# EAGLE design MMMM Top (EAGLE 9.1.1)
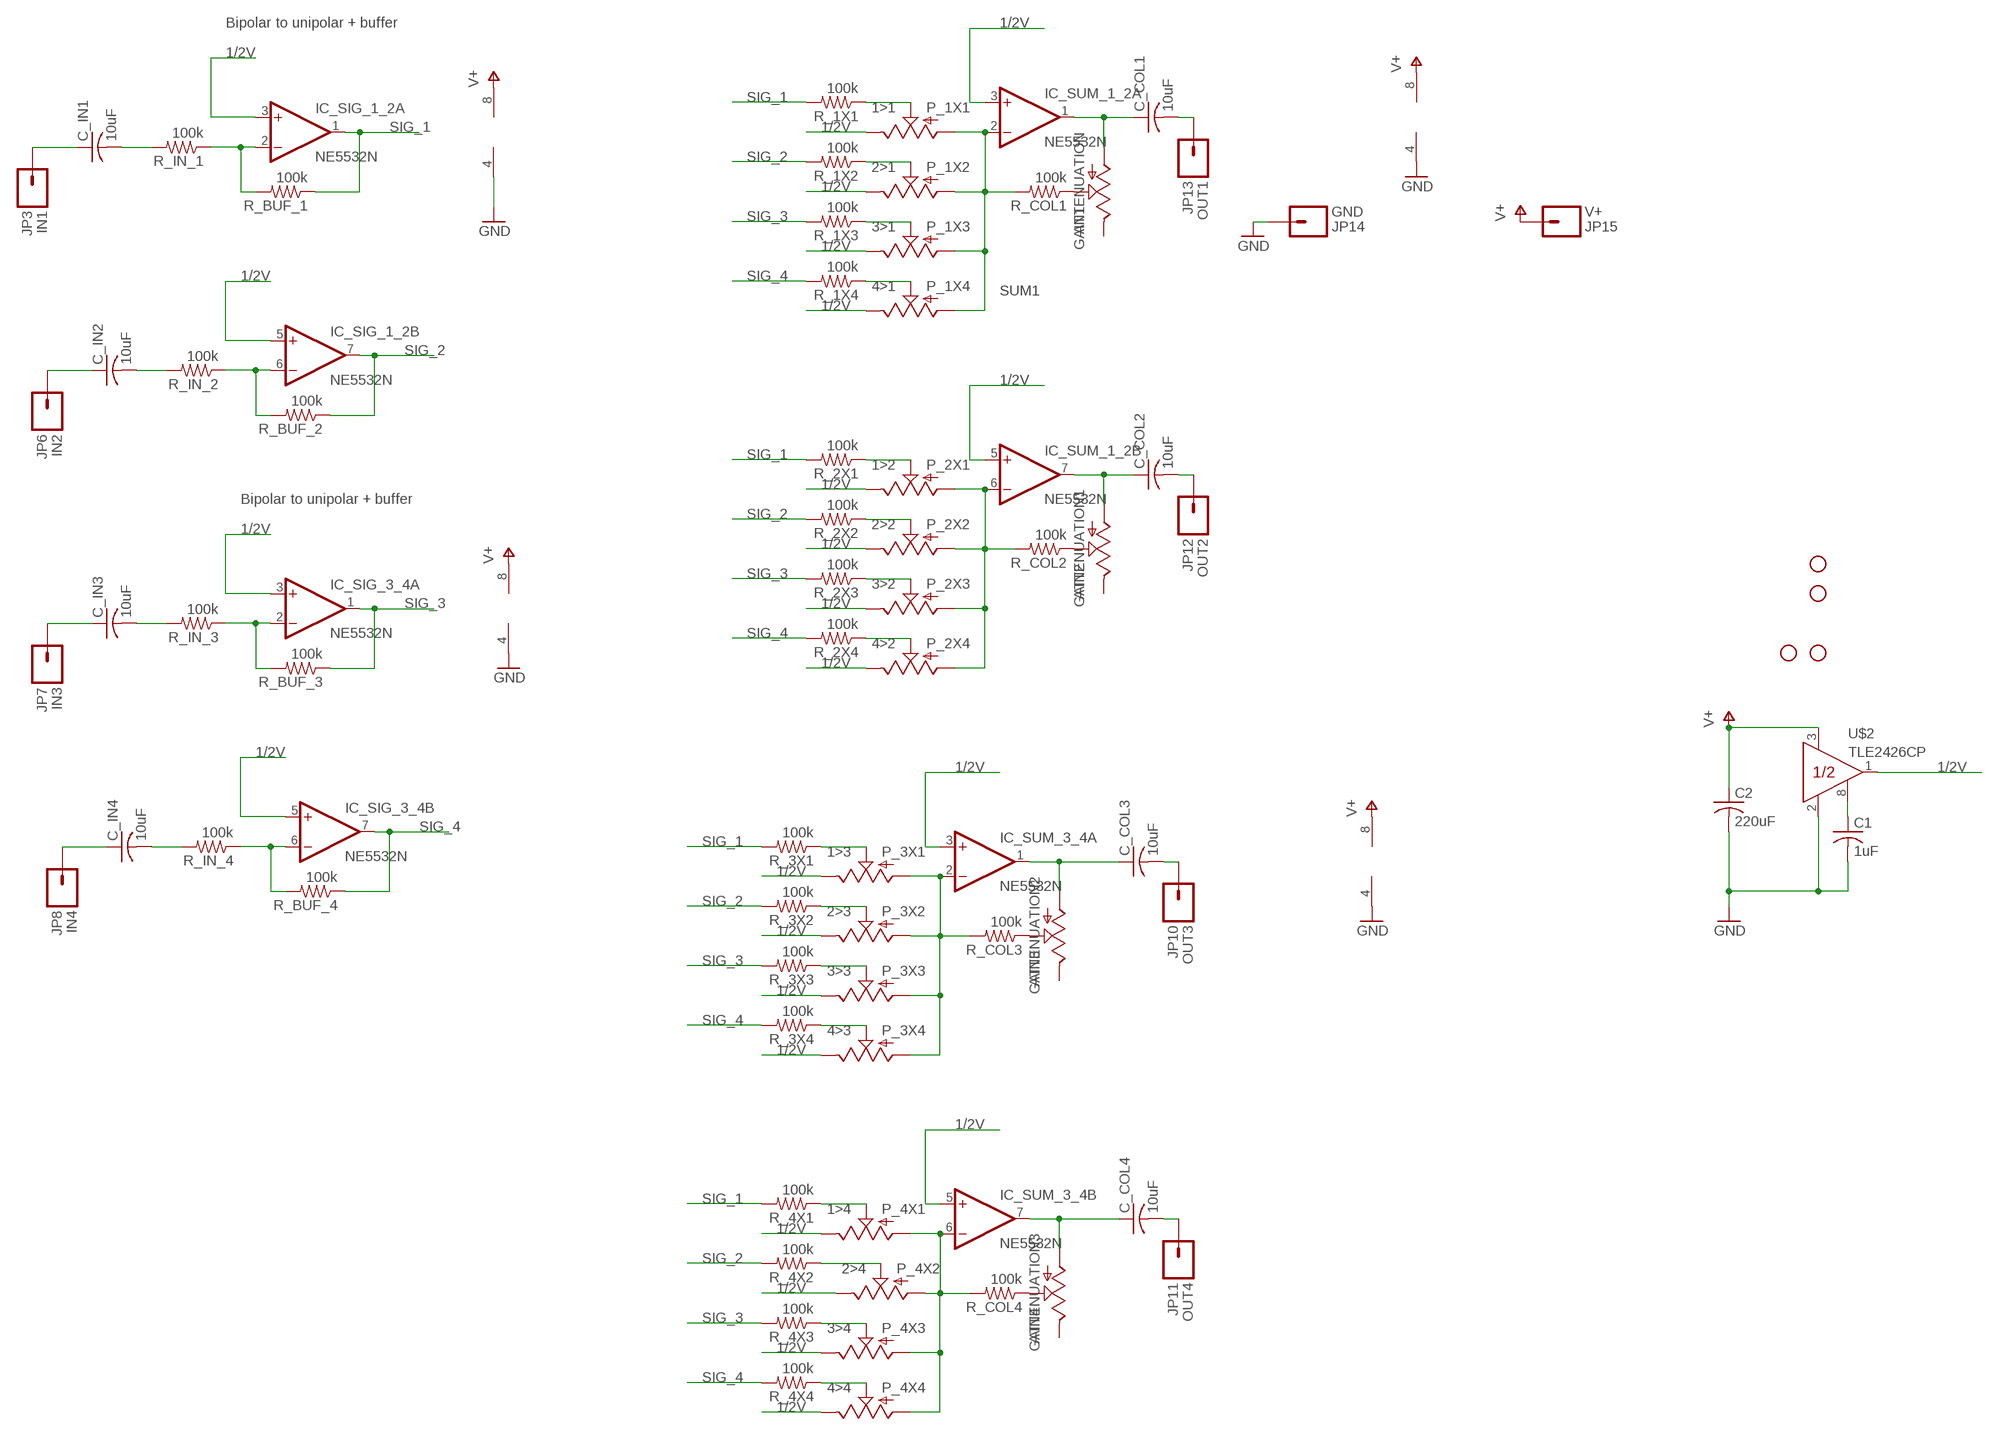
[diagram p0: schematic, sheet 1]

## Parts
ATTENUATION  GAIN1  POTTRIM  [TRIM_POT]
ATTENUATION1  GAIN2  POTTRIM  [TRIM_POT]
ATTENUATION2  GAIN3  POTTRIM  [TRIM_POT]
ATTENUATION3  GAIN4  POTTRIM  [TRIM_POT]
C1  1uF  C-US025-030X050  [C025-030X050]
C2  220uF  C-US050-075X075  [C050-075X075]
C_COL1  10uF  C-US025-025X050  [C025-025X050]
C_COL2  10uF  C-US025-025X050  [C025-025X050]
C_COL3  10uF  C-US025-025X050  [C025-025X050]
C_COL4  10uF  C-US025-025X050  [C025-025X050]
C_IN1  10uF  C-US025-025X050  [C025-025X050]
C_IN2  10uF  C-US025-025X050  [C025-025X050]
C_IN3  10uF  C-US025-025X050  [C025-025X050]
C_IN4  10uF  C-US025-025X050  [C025-025X050]
IC_SIG_1_2  NE5532N  [DIL08]
IC_SIG_3_4  NE5532N  [DIL08]
IC_SUM_1_2  NE5532N  [DIL08]
IC_SUM_3_4  NE5532N  [DIL08]
JP1  STAND-OFF  [STAND-OFF]
JP2  STAND-OFF  [STAND-OFF]
JP3  IN1  HEADER-1X1  [1X01_SIDE_NAME]
JP4  STAND-OFF  [STAND-OFF]
JP5  STAND-OFF  [STAND-OFF]
JP6  IN2  HEADER-1X1  [1X01_SIDE_NAME]
JP7  IN3  HEADER-1X1  [1X01_SIDE_NAME]
JP8  IN4  HEADER-1X1  [1X01_SIDE_NAME]
JP10  OUT3  HEADER-1X1  [1X01_SIDE_NAME]
JP11  OUT4  HEADER-1X1  [1X01_SIDE_NAME]
JP12  OUT2  HEADER-1X1  [1X01_SIDE_NAME]
JP13  OUT1  HEADER-1X1  [1X01_SIDE_NAME]
JP14  GND  HEADER-1X1  [1X01_SIDE_NAME]
JP15  V+  HEADER-1X1  [1X01_SIDE_NAME]
P_1X1  1>1  POT  [ALPS_POT]
P_1X2  2>1  POT  [ALPS_POT]
P_1X3  3>1  POT  [ALPS_POT]
P_1X4  4>1  POT  [ALPS_POT]
P_2X1  1>2  POT  [ALPS_POT]
P_2X2  2>2  POT  [ALPS_POT]
P_2X3  3>2  POT  [ALPS_POT]
P_2X4  4>2  POT  [ALPS_POT]
P_3X1  1>3  POT  [ALPS_POT]
P_3X2  2>3  POT  [ALPS_POT]
P_3X3  3>3  POT  [ALPS_POT]
P_3X4  4>3  POT  [ALPS_POT]
P_4X1  1>4  POT  [ALPS_POT]
P_4X2  2>4  POT  [ALPS_POT]
P_4X3  3>4  POT  [ALPS_POT]
P_4X4  4>4  POT  [ALPS_POT]
R_1X1  100k  R-US_0204/5  [0204/5]
R_1X2  100k  R-US_0204/5  [0204/5]
R_1X3  100k  R-US_0204/5  [0204/5]
R_1X4  100k  R-US_0204/5  [0204/5]
R_2X1  100k  R-US_0204/5  [0204/5]
R_2X2  100k  R-US_0204/5  [0204/5]
R_2X3  100k  R-US_0204/5  [0204/5]
R_2X4  100k  R-US_0204/5  [0204/5]
R_3X1  100k  R-US_0204/5  [0204/5]
R_3X2  100k  R-US_0204/5  [0204/5]
R_3X3  100k  R-US_0204/5  [0204/5]
R_3X4  100k  R-US_0204/5  [0204/5]
R_4X1  100k  R-US_0204/5  [0204/5]
R_4X2  100k  R-US_0204/5  [0204/5]
R_4X3  100k  R-US_0204/5  [0204/5]
R_4X4  100k  R-US_0204/5  [0204/5]
R_BUF_1  100k  R-US_0204/5  [0204/5]
R_BUF_2  100k  R-US_0204/5  [0204/5]
R_BUF_3  100k  R-US_0204/5  [0204/5]
R_BUF_4  100k  R-US_0204/5  [0204/5]
R_COL1  100k  R-US_0204/5  [0204/5]
R_COL2  100k  R-US_0204/5  [0204/5]
R_COL3  100k  R-US_0204/5  [0204/5]
R_COL4  100k  R-US_0204/5  [0204/5]
R_IN_1  100k  R-US_0204/5  [0204/5]
R_IN_2  100k  R-US_0204/5  [0204/5]
R_IN_3  100k  R-US_0204/5  [0204/5]
R_IN_4  100k  R-US_0204/5  [0204/5]
U$2  TLE2426CP  [DIP-8]

## Nets
1/2V: IC_SIG_1_2.3(A:+IN) IC_SIG_1_2.5(B:+IN) IC_SIG_3_4.3(A:+IN) IC_SIG_3_4.5(B:+IN) IC_SUM_1_2.3(A:+IN) IC_SUM_1_2.5(B:+IN) IC_SUM_3_4.3(A:+IN) IC_SUM_3_4.5(B:+IN) P_1X1.P$1(E) P_1X2.P$1(E) P_1X3.P$1(E) P_1X4.P$1(E) P_2X1.P$1(E) P_2X2.P$1(E) P_2X3.P$1(E) P_2X4.P$1(E) P_3X1.P$1(E) P_3X2.P$1(E) P_3X3.P$1(E) P_3X4.P$1(E) P_4X1.P$1(E) P_4X2.P$1(E) P_4X3.P$1(E) P_4X4.P$1(E) U$2.1(OUT)
GND: C1.2 C2.2 IC_SIG_1_2.4(P:V-) IC_SIG_3_4.4(P:V-) IC_SUM_1_2.4(P:V-) IC_SUM_3_4.4(P:V-) JP14.1 U$2.2(COM)
IN1: C_IN1.1 JP3.1
N$1: ATTENUATION.1(S) R_COL1.1
N$2: IC_SIG_1_2.2(A:-IN) R_BUF_1.2 R_IN_1.1
N$3: C_COL1.2 JP13.1
N$4: P_2X1.P$2(S) R_2X1.1
N$5: ATTENUATION1.1(S) R_COL2.1
N$6: C_IN1.2 R_IN_1.2
N$7: IC_SIG_1_2.6(B:-IN) R_BUF_2.2 R_IN_2.1
N$8: C_IN2.2 R_IN_2.2
N$9: C_IN2.1 JP6.1
N$10: P_1X1.P$2(S) R_1X1.1
N$11: C1.1 U$2.8(NR)
N$12: IC_SIG_3_4.2(A:-IN) R_BUF_3.2 R_IN_3.1
N$13: C_IN3.2 R_IN_3.2
N$14: C_IN3.1 JP7.1
N$15: IC_SIG_3_4.6(B:-IN) R_BUF_4.2 R_IN_4.1
N$16: C_IN4.2 R_IN_4.2
N$17: C_IN4.1 JP8.1
N$18: ATTENUATION1.3(A) C_COL2.1 IC_SUM_1_2.7(B:OUT)
N$19: P_1X3.P$2(S) R_1X3.1
N$21: P_1X4.P$2(S) R_1X4.1
N$22: ATTENUATION.3(A) C_COL1.1 IC_SUM_1_2.1(A:OUT)
N$23: ATTENUATION2.1(S) R_COL3.1
N$24: ATTENUATION3.1(S) R_COL4.1
N$25: P_1X2.P$2(S) R_1X2.1
N$26: P_2X2.P$2(S) R_2X2.1
N$27: C_COL2.2 JP12.1
N$28: P_2X3.P$2(S) R_2X3.1
N$29: IC_SUM_1_2.6(B:-IN) P_2X1.P$3(A) P_2X2.P$3(A) P_2X3.P$3(A) P_2X4.P$3(A) R_COL2.2
N$30: P_2X4.P$2(S) R_2X4.1
N$31: P_3X1.P$2(S) R_3X1.1
N$32: ATTENUATION2.3(A) C_COL3.1 IC_SUM_3_4.1(A:OUT)
N$34: P_3X2.P$2(S) R_3X2.1
N$35: C_COL3.2 JP10.1
N$36: P_3X3.P$2(S) R_3X3.1
N$37: IC_SUM_3_4.2(A:-IN) P_3X1.P$3(A) P_3X2.P$3(A) P_3X3.P$3(A) P_3X4.P$3(A) R_COL3.2
N$38: P_3X4.P$2(S) R_3X4.1
N$39: P_4X1.P$2(S) R_4X1.1
N$40: ATTENUATION3.3(A) C_COL4.1 IC_SUM_3_4.7(B:OUT)
N$42: P_4X2.P$2(S) R_4X2.1
N$43: C_COL4.2 JP11.1
N$44: P_4X3.P$2(S) R_4X3.1
N$45: IC_SUM_3_4.6(B:-IN) P_4X1.P$3(A) P_4X2.P$3(A) P_4X3.P$3(A) P_4X4.P$3(A) R_COL4.2
N$46: P_4X4.P$2(S) R_4X4.1
SIG_1: IC_SIG_1_2.1(A:OUT) R_1X1.2 R_2X1.2 R_3X1.2 R_4X1.2 R_BUF_1.1
SIG_2: IC_SIG_1_2.7(B:OUT) R_1X2.2 R_2X2.2 R_3X2.2 R_4X2.2 R_BUF_2.1
SIG_3: IC_SIG_3_4.1(A:OUT) R_1X3.2 R_2X3.2 R_3X3.2 R_4X3.2 R_BUF_3.1
SIG_4: IC_SIG_3_4.7(B:OUT) R_1X4.2 R_2X4.2 R_3X4.2 R_4X4.2 R_BUF_4.1
SUM1: IC_SUM_1_2.2(A:-IN) P_1X1.P$3(A) P_1X2.P$3(A) P_1X3.P$3(A) P_1X4.P$3(A) R_COL1.2
V+: C2.1 IC_SIG_1_2.8(P:V+) IC_SIG_3_4.8(P:V+) IC_SUM_1_2.8(P:V+) IC_SUM_3_4.8(P:V+) JP15.1 U$2.3(IN)
Unconnected: ATTENUATION1.2(E) ATTENUATION2.2(E) ATTENUATION3.2(E) ATTENUATION.2(E)

## Notes on the sheet
- Bipolar to unipolar + buffer
- Bipolar to unipolar + buffer

## Library data of the parts
ATTENUATION ATTENUATION1-ATTENUATION3 = SparkFun-Electromechanical:POT
C1 C2 C_COL1-C_COL4 C_IN1-C_IN4 = adafruit:C-US: CAPACITOR, American symbol
IC_SIG_1_2 IC_SIG_3_4 IC_SUM_1_2 IC_SUM_3_4 = linear:NE5532: AUDIO AMPLIFIER
JP1 JP2 JP4 JP5 = SparkFun:STAND-OFF: Stand Off This is the mechanical footprint for a #4 phillips button head screw. Use the keepout ring to avoid running the screw head into surrounding components. SKU : PRT-00447
JP3 JP6-JP8 JP10-JP15 = TOF:HEADER-1X1: Header 1 Standard 1-pin 0.1" header. Use with straight break away headers (SKU : PRT-00116), right angle break away headers (PRT-00553), swiss pins (PRT-00743), machine pins (PRT-00117), and female headers (PRT-00115).
P_1X1-P_1X4 P_2X1-P_2X4 P_3X1-P_3X4 P_4X1-P_4X4 = SparkFun-Electromechanical:POT; PROD_ID: RES-09177
R_1X1-R_1X4 R_2X1-R_2X4 R_3X1-R_3X4 R_4X1-R_4X4 R_BUF_1-R_BUF_4 R_COL1-R_COL4 R_IN_1-R_IN_4 = adafruit:R-US_: RESISTOR, American symbol
U$2 = tle2426:TLE2426*: Texas Instruments "rail splitter" with noise-reduction

## Board
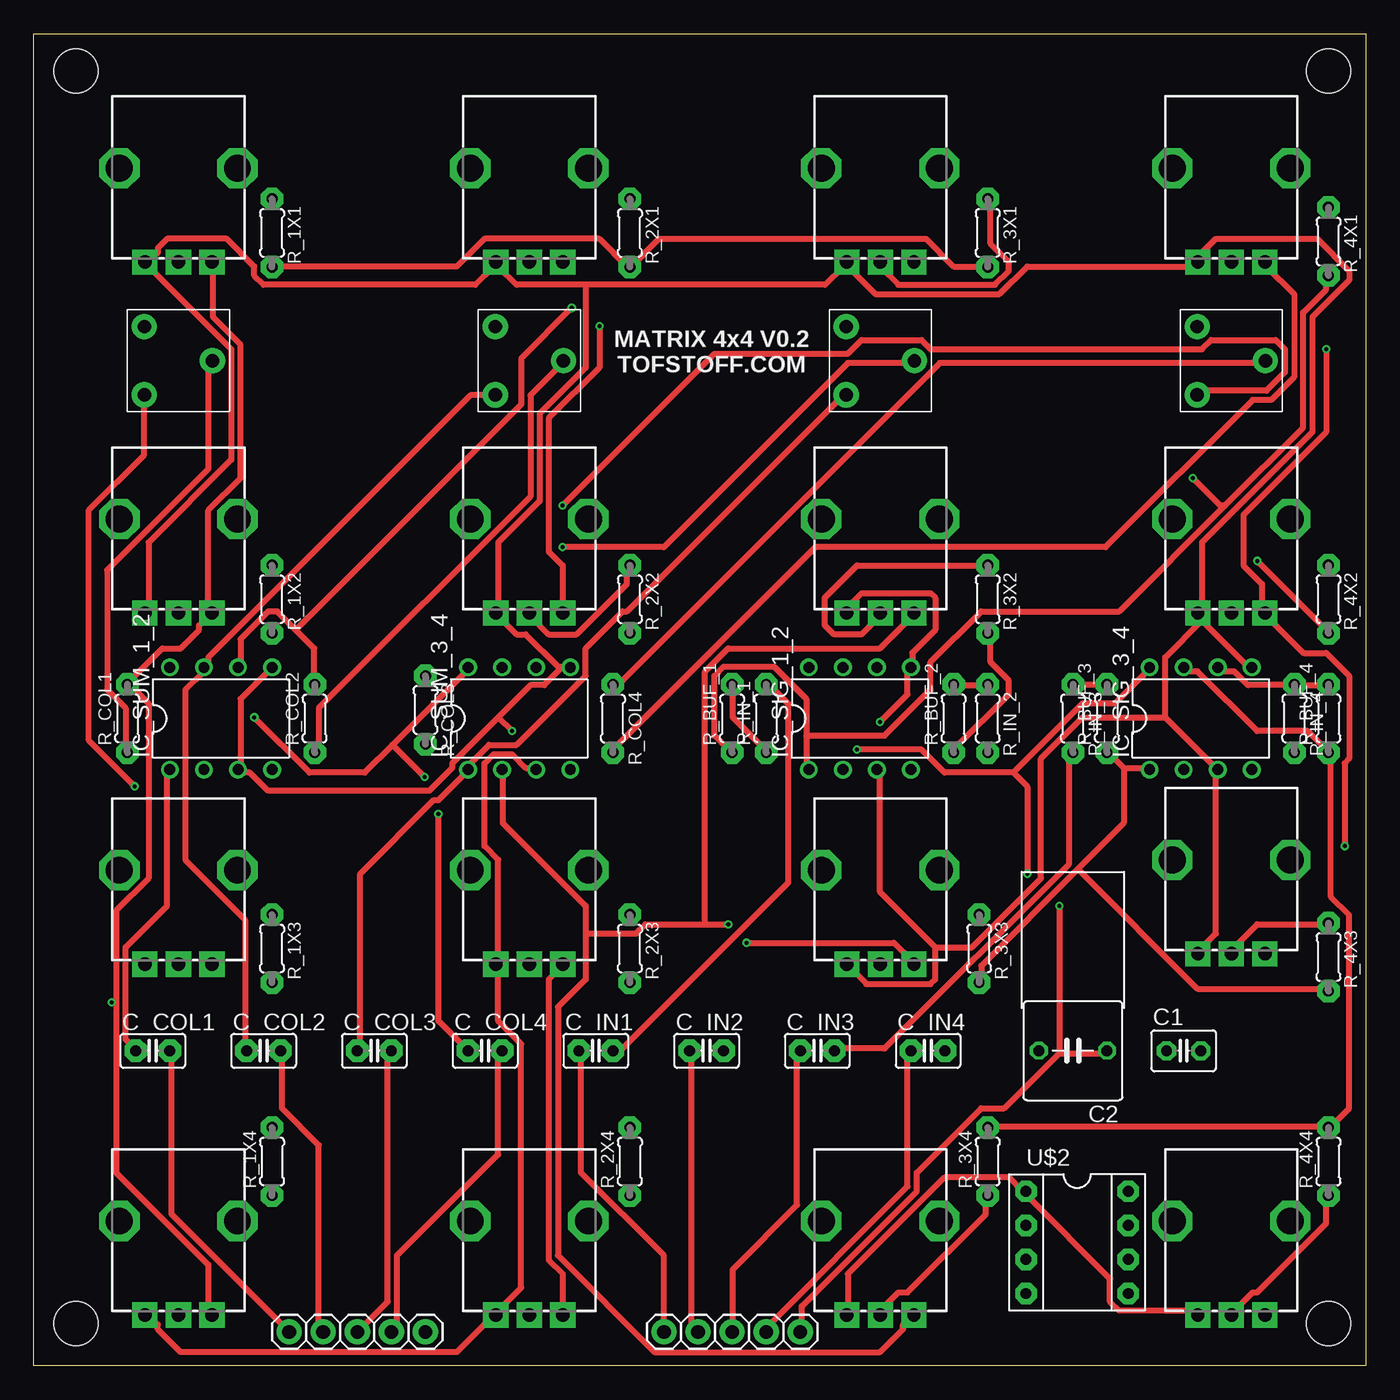
[diagram p1: board, top side]
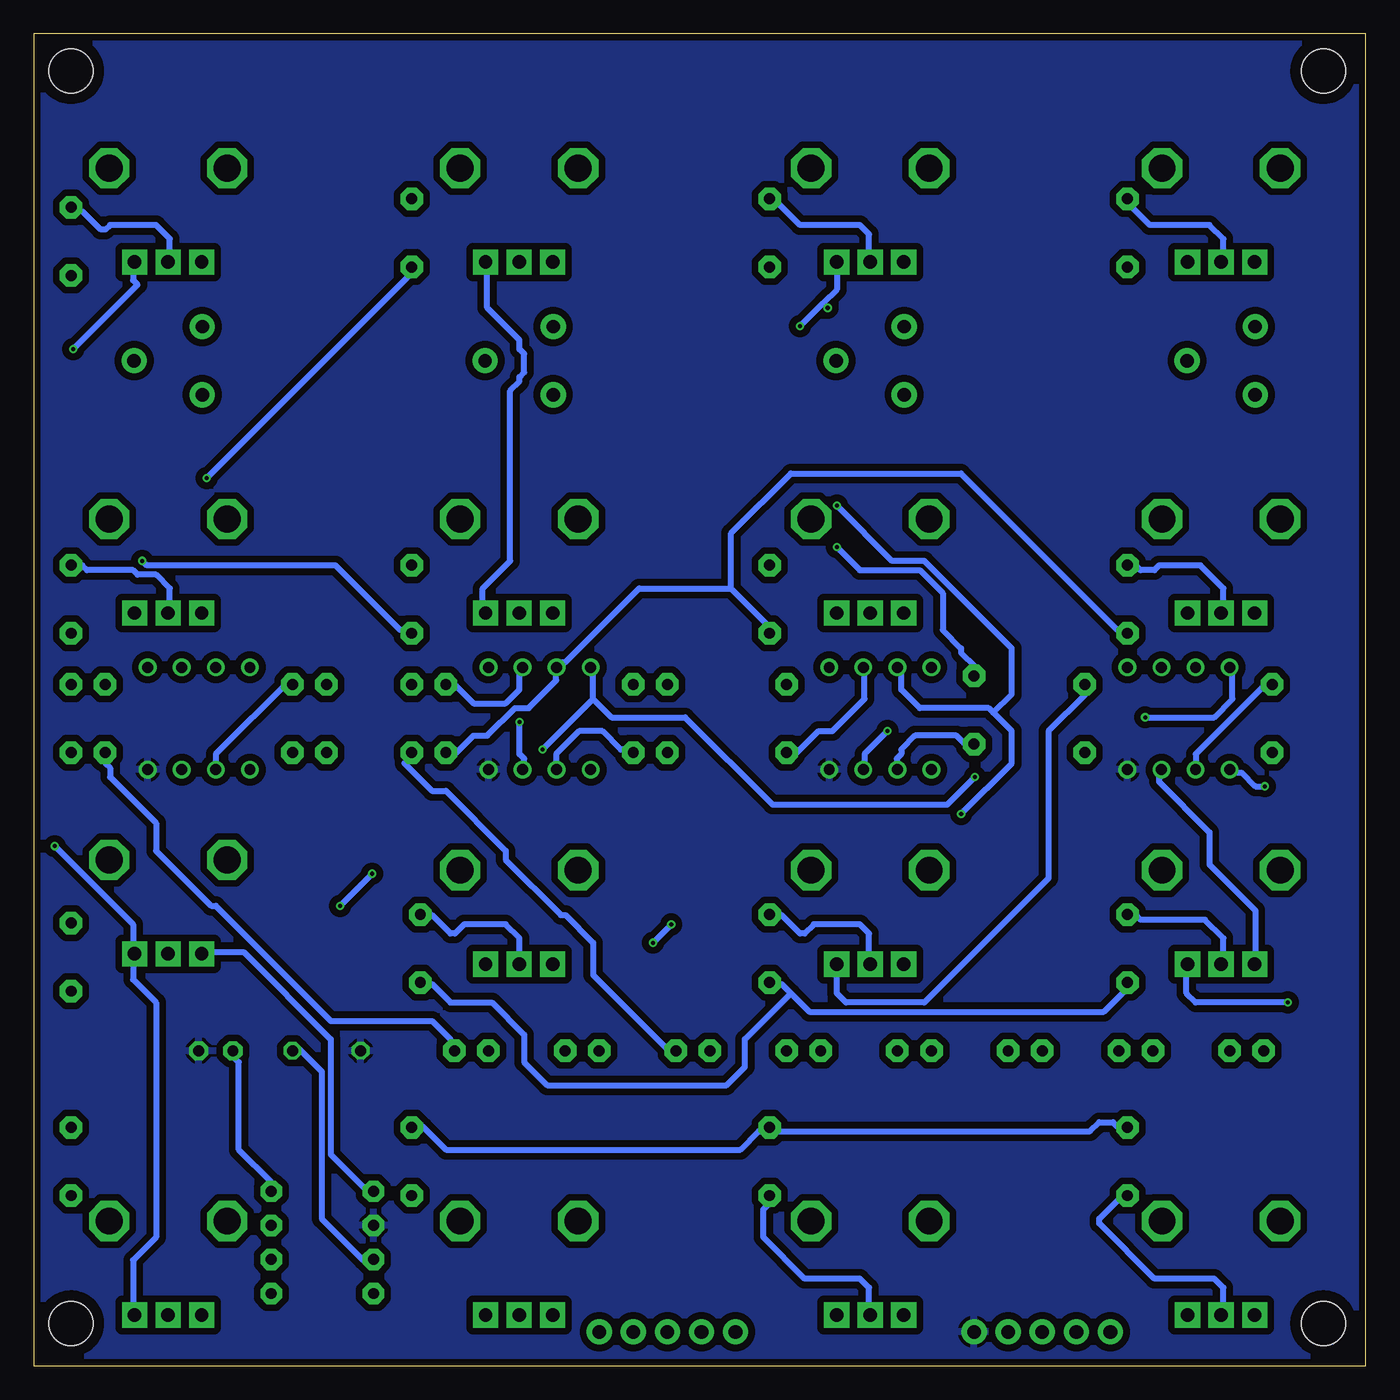
[diagram p2: board, bottom side, seen from below]

Size 99.31 x 99.31 mm. Coordinates in mm from the lower left corner, seen from the top.
Outline: 0,0 0,99.31 99.31,99.31 99.31,0 0,0
Copper layers (1*16): Top 0.035mm / dielectric 1.5mm / Bottom 0.035mm
Design rules "EagleRules *": minimum track width 17mil, minimum drill 12mil, track to track 10mil, track to pad 10mil, pad to pad 7mil, via to via 7mil, smd to smd 0mil, copper to edge 20mil, drill to drill 10mil, minimum pad ring 10mil, minimum via ring 6mil, stop-mask expansion 2mil, vias tented up to drill 25mil, thermal gap 10mil

### Footprints (pad centres in the part's own frame; a part is rotated, then mirrored left to right if it is on the bottom)
TRIM_POT = drill 1 pad 1.88: 1 5.08,0; 2 0,2.54; 3 0,-2.54
C025-030X050 = drill 0.813 pad 1.422 octagon: 1 -1.27,0; 2 1.27,0
C050-075X075 = drill 0.813 octagon: 1 -2.54,0; 2 2.54,0
C025-025X050 = drill 0.813 pad 1.676 octagon: 1 -1.27,0; 2 1.27,0
DIL08 = drill 0.813 pad 1.27: 1 -3.81,-3.81; 2 -1.27,-3.81; 3 1.27,-3.81; 4 3.81,-3.81; 5 3.81,3.81; 6 1.27,3.81; 7 -1.27,3.81; 8 -3.81,3.81
STAND-OFF = hole 3.302: 0,0
1X01_SIDE_NAME = drill 1.016 pad 1.88: 1 0,0
ALPS_POT = drill 1 pad 1.88 square: P$1 7,-2.5; P$2 7,0; P$3 7,2.5 | drill 2 octagon: P$4 0,-4.4; P$5 0,4.4
0204/5 = drill 0.813 pad 1.676 octagon: 1 -2.54,0; 2 2.54,0
DIP-8 = drill 0.813 pad 1.6 octagon: 1 -3.81,3.81; 2 -3.81,1.27; 3 -3.81,-1.27; 4 -3.81,-3.81; 5 3.81,-3.81; 6 3.81,-1.27; 7 3.81,1.27; 8 3.81,3.81

### Placement (x,y rotation side)
ATTENUATION  8.26,74.93 0 top
ATTENUATION1  34.42,74.93 0 top
ATTENUATION2  60.58,74.93 0 top
ATTENUATION3  86.74,74.93 0 top
C1  85.72,23.5 0 top
C2  77.47,23.5 180 top
C_COL1  8.89,23.5 0 top
C_COL2  17.14,23.5 0 top
C_COL3  25.4,23.5 0 top
C_COL4  33.66,23.5 0 top
C_IN1  41.91,23.5 0 top
C_IN2  50.16,23.5 0 top
C_IN3  58.42,23.5 0 top
C_IN4  66.67,23.5 0 top
IC_SIG_1_2  61.59,48.26 0 top
IC_SIG_3_4  87,48.26 0 top
IC_SUM_1_2  13.97,48.26 0 top
IC_SUM_3_4  36.2,48.26 0 top
JP1  3.17,3.17 0 top
JP2  3.17,96.52 0 top
JP3  46.99,2.54 90 top
JP4  96.52,3.17 0 top
JP5  96.52,96.52 0 top
JP6  49.53,2.54 90 top
JP7  52.07,2.54 90 top
JP8  54.61,2.54 90 top
JP10  24.13,2.54 90 top
JP11  26.67,2.54 90 top
JP12  21.59,2.54 90 top
JP13  19.05,2.54 90 top
JP14  29.21,2.54 90 top
JP15  57.15,2.54 90 top
P_1X1  10.79,89.28 270 top
P_1X2  10.79,63.12 270 top
P_1X3  10.79,36.96 270 top
P_1X4  10.79,10.79 270 top
P_2X1  36.96,89.28 270 top
P_2X2  36.96,63.12 270 top
P_2X3  36.96,36.96 270 top
P_2X4  36.96,10.79 270 top
P_3X1  63.12,89.28 270 top
P_3X2  63.12,63.12 270 top
P_3X3  63.12,36.96 270 top
P_3X4  63.12,10.79 270 top
P_4X1  89.28,89.28 270 top
P_4X2  89.28,63.12 270 top
P_4X3  89.28,37.72 270 top
P_4X4  89.28,10.79 270 top
R_1X1  17.78,84.45 270 top
R_1X2  17.78,57.15 270 top
R_1X3  17.78,31.11 270 top
R_1X4  17.78,15.24 90 top
R_2X1  44.45,84.45 270 top
R_2X2  44.45,57.15 270 top
R_2X3  44.45,31.11 270 top
R_2X4  44.45,15.24 90 top
R_3X1  71.12,84.45 270 top
R_3X2  71.12,57.15 270 top
R_3X3  70.48,31.11 270 top
R_3X4  71.12,15.24 90 top
R_4X1  96.52,83.82 270 top
R_4X2  96.52,57.15 270 top
R_4X3  96.52,30.48 270 top
R_4X4  96.52,15.24 90 top
R_BUF_1  52.07,48.26 90 top
R_BUF_2  68.58,48.26 90 top
R_BUF_3  80.01,48.26 90 top
R_BUF_4  96.52,48.26 90 top
R_COL1  6.99,48.26 90 top
R_COL2  20.95,48.26 90 top
R_COL3  29.21,48.9 270 top
R_COL4  43.18,48.26 270 top
R_IN_1  54.61,48.26 90 top
R_IN_2  71.12,48.26 270 top
R_IN_3  77.47,48.26 270 top
R_IN_4  93.98,48.26 270 top
U$2  77.79,9.21 0 top

### Tracks (layer width: path | path; a pad name or v marks a point on that pad's centre or on a via)
1/2V  (via drill 0.3)
  Top 0.432: P_4X4.P$1 86.75,4.12 80.92,4.12 80.24,4.8 80.24,6.51 74.07,12.69 U$2.1 73.72,13.03 72.69,14.06 67.89,14.06 60.69,6.86 60.69,4.12 P_3X4.P$1 | 87.1,55.55 86.75,55.89 P_4X2.P$1 | 87.1,55.55 90.53,52.12 IC_SIG_3_4.5 | P_4X3.P$1 86.75,30.86 88.12,32.23 88.12,44.23 IC_SIG_3_4.3 88.12,44.58 84.35,48.35 | 87.1,55.55 84.35,52.81 84.35,48.35 | 87.1,55.55 P_4X2.P$1 | P_3X2.P$1 60.35,56.24 61.72,57.61 66.86,57.61 67.21,57.26 67.21,54.86 65.49,53.15 65.49,52.12 IC_SIG_1_2.5 65.15,51.78 65.15,50.06 v63.09,48.01 | 67.21,31.2 63.09,35.32 63.09,44.23 IC_SIG_1_2.3 | 67.21,31.2 67.21,28.8 66.86,28.46 62.06,28.46 60.69,29.83 P_3X3.P$1 | 84.35,48.35 78.18,48.35 75.09,45.26 75.09,36.35 69.95,31.2 67.21,31.2 | IC_SUM_3_4.3 37.38,44.58 36.69,44.58 35.66,45.61 34.29,45.61 33.6,44.92 33.6,38.75 34.63,37.72 34.63,30.18 P_2X3.P$1 34.63,29.83 34.63,25.72 36.35,24 36.35,5.83 34.63,4.12 P_2X4.P$1 34.29,3.77 31.55,1.03 10.97,1.03 9.26,2.74 9.26,3.09 8.57,3.77 P_1X4.P$1 | P_1X2.P$1 8.57,56.24 8.57,61.38 14.74,67.55 14.74,75.78 8.57,81.95 P_1X1.P$1 8.57,82.3 9.26,82.98 9.26,83.33 9.94,84.01 14.4,84.01 16.46,81.95 16.46,81.27 17.14,80.58 32.92,80.58 34.29,81.95 P_2X1.P$1 34.63,81.95 36.01,80.58 41.15,80.58 | IC_SUM_1_2.5 15.43,49.72 15.43,44.58 IC_SUM_1_2.3 15.43,44.23 16.12,44.23 17.49,42.86 29.49,42.86 31.2,44.58 31.2,44.92 34.63,48.35 | 39.43,52.12 39.09,52.12 36.69,54.52 36.01,54.52 34.63,55.89 P_2X2.P$1 34.63,56.24 34.63,61.38 37.72,64.47 37.72,70.98 41.15,74.41 41.15,80.58 | 39.43,52.12 39.78,52.12 IC_SUM_3_4.5 39.43,52.12 | 41.15,80.58 58.98,80.58 60.35,81.95 P_3X1.P$1 60.69,81.95 62.75,79.9 72.01,79.9 74.07,81.95 86.75,81.95 P_4X1.P$1 87.1,82.3 87.1,82.98 88.12,84.01 95.67,84.01 98.07,81.61 98.07,80.92 95.33,78.18 95.33,69.61 87.1,61.38 87.1,56.24 P_4X2.P$1
  Top 0.432: 34.63,48.35 37.03,50.75 38.06,50.75 39.43,52.12 | 34.63,48.35 v35.66,47.32
  Bottom 0.432: v63.09,48.01 63.09,45.61 62.75,45.26 62.75,44.58 IC_SIG_1_2.3 | U$2.1 74.07,13.03 74.41,13.03 77.15,15.77 77.15,24.35 83.67,30.86 86.75,30.86 P_4X3.P$1 | P_1X3.P$1 8.23,30.18 8.23,33.95 11.66,37.38 11.66,39.78 15.43,43.55 15.43,44.23 IC_SUM_1_2.3 | v35.66,47.32 37.38,45.61 37.38,44.58 IC_SUM_3_4.3
GND
  pour Bottom (isolate 0.508): 0,99.06 99.06,99.06 99.06,0.64 0,0.64
IN1
  Top 0.432: C_IN1.1 40.8,23.32 40.8,14.4 46.98,8.23 46.98,2.74 JP3.1
N$1
  Top 0.432: R_COL1.1 6.86,45.95 6.86,49.03 5.49,50.41 5.49,59.32 13.03,66.86 13.03,74.75 ATTENUATION.1
N$2
  Top 0.432: R_BUF_1.2 52.12,50.75 52.12,48.35 54.52,45.95 R_IN_1.1
  Bottom 0.432: IC_SIG_1_2.2 60.35,44.58 60.35,45.61 58.64,47.32 56.92,47.32 55.55,45.95 54.86,45.95 R_IN_1.1
N$3
  Top 0.432: C_COL1.2 10.29,23.32 10.29,11.32 18.86,2.74 JP13.1
N$4
  Bottom 0.432: R_2X1.1 44.23,86.75 43.89,86.75 42.18,85.04 37.72,85.04 37.03,84.35 37.03,82.3 P_2X1.P$2
N$5
  Top 0.432: R_COL2.1 21.26,45.95 21.26,49.03 37.03,64.81 37.03,72.35 39.43,74.75 ATTENUATION1.1
N$6
  Top 0.432: C_IN1.2 43.2,23.66 43.89,23.66 56.24,36.01 56.24,49.38 54.86,50.75 R_IN_1.2
N$7
  Top 0.432: R_IN_2.1 70.98,50.75 68.58,50.75 R_BUF_2.2
  Bottom 0.432: IC_SIG_1_2.6 63.09,51.78 63.09,50.41 64.12,49.38 66.52,49.38 67.89,50.75 68.58,50.75 R_BUF_2.2
N$8
  Bottom 0.432: C_IN2.2 51.44,23.66 52.12,23.66 57.61,29.15 57.61,31.55 59.66,33.6 60.01,33.6 64.12,37.72 64.12,38.41 68.58,42.86 69.61,42.86 71.67,44.92 70.98,45.61 R_IN_2.2
N$9
  Top 0.432: C_IN2.1 49.03,23.32 49.03,3.09 49.38,2.74 JP6.1
N$10
  Bottom 0.432: R_1X1.1 17.49,86.75 17.49,86.41 16.12,85.04 11.66,85.04 10.63,84.01 10.63,82.3 P_1X1.P$2
N$11
  Bottom 0.432: C1.1 84.35,23.32 84.35,22.97 84.01,22.63 84.01,16.12 81.61,13.72 U$2.8
N$12
  Top 0.432: R_IN_3.1 77.5,50.75 79.9,50.75 R_BUF_3.2
  Bottom 0.432: IC_SIG_3_4.2 85.72,45.61 80.24,51.09 R_BUF_3.2
N$13
  Top 0.432: C_IN3.2 60.01,23.66 63.44,23.66 77.15,37.38 77.15,45.61 R_IN_3.2
N$14
  Top 0.432: C_IN3.1 56.92,23.32 56.92,12 52.12,7.2 52.12,2.74 JP7.1
N$15
  Top 0.432: IC_SIG_3_4.6 88.47,51.78 89.5,51.78 90.53,50.75 93.95,50.75 R_IN_4.1 94.3,50.75 96.36,50.75 R_BUF_4.2
N$16
  Bottom 0.432: C_IN4.2 68.24,23.66 68.24,24.35 69.61,25.72 77.15,25.72 85.72,34.29 86.07,34.29 90.18,38.41 90.18,40.46 93.61,43.89 93.61,44.58 93.95,44.92 93.95,45.61 R_IN_4.2
N$17
  Top 0.432: C_IN4.1 65.15,23.32 65.15,13.37 54.52,2.74 JP8.1
N$18
  Top 0.432: ATTENUATION1.3 34.29,72.35 32.58,72.35 13.03,52.81 13.03,52.12 IC_SUM_1_2.7 12.69,51.78 11.32,50.41 11.32,37.72 15.77,33.26 15.77,23.66 C_COL2.1
N$19
  Bottom 0.432: R_1X3.1 17.49,33.6 17.14,33.6 16.8,33.26 12,33.26 10.63,31.89 10.63,30.18 P_1X3.P$2
N$21
  Bottom 0.432: R_1X4.1 17.83,12.69 18.17,12.69 19.89,10.97 19.89,10.63 15.77,6.51 11.32,6.51 10.63,5.83 10.63,4.12 P_1X4.P$2
N$22  (via drill 0.3)
  Top 0.432: IC_SUM_1_2.1 9.94,44.23 9.94,34.29 6.86,31.2 6.86,24.35 7.54,23.66 C_COL1.1 | v7.54,43.2 4.12,46.63 4.12,63.78 8.23,67.89 8.23,72.35 ATTENUATION.3
  Bottom 0.432: v7.54,43.2 8.23,43.2 9.26,44.23 9.94,44.23 IC_SUM_1_2.1
N$23  (via drill 0.3)
  Top 0.432: v39.43,61.04 46.98,61.04 60.69,74.75 65.49,74.75 ATTENUATION2.1
  Bottom 0.432: v39.43,61.04 37.72,59.32 33.26,59.32 31.55,57.61 31.55,54.86 30.18,53.49 30.18,53.15 29.15,52.12 29.15,51.44 R_COL3.1
N$24
  Top 0.432: R_COL4.1 43.2,51.09 43.89,51.09 67.55,74.75 91.55,74.75 ATTENUATION3.1
N$25
  Bottom 0.432: R_1X2.1 17.49,59.66 17.14,59.66 16.8,59.32 15.77,59.32 15.43,59.66 12.34,59.66 10.63,57.95 10.63,56.24 P_1X2.P$2
N$26
  Top 0.432: R_2X2.1 44.23,59.66 44.23,58.29 40.46,54.52 38.41,54.52 37.03,55.89 P_2X2.P$2
N$27
  Top 0.432: C_COL2.2 18.52,23.32 18.52,19.2 21.26,16.46 21.26,2.74 JP12.1
N$28
  Bottom 0.432: R_2X3.1 44.23,33.6 43.55,33.6 42.18,32.23 41.83,32.23 41.15,32.92 37.72,32.92 37.03,32.23 37.03,30.18 P_2X3.P$2
N$29  (via drill 0.3)
  Top 0.432: P_2X4.P$3 39.43,4.12 39.43,6.86 38.41,7.89 38.41,28.8 39.43,29.83 P_2X3.P$3 | 19.55,54.86 20.92,53.49 20.92,51.09 R_COL2.2 | 19.55,54.86 18.17,56.24 17.49,56.24 15.43,54.18 15.43,52.12 IC_SUM_1_2.6 | v42.18,77.5 42.18,74.41 38.41,70.64 38.41,60.69 39.43,59.66 39.43,56.24 P_2X2.P$3 | 19.55,54.86 36.35,71.67 36.35,75.09 v40.12,78.87
  Bottom 0.432: 40.46,79.21 39.43,80.24 39.43,81.95 P_2X1.P$3 | 40.46,79.21 v42.18,77.5 | 40.46,79.21 v40.12,78.87 | P_2X3.P$3 39.43,29.83 39.43,27.77 38.75,27.09 32.92,27.09 23.66,36.35 23.66,47.32 20.92,50.06 20.92,50.75 R_COL2.2
N$30
  Bottom 0.432: R_2X4.1 44.58,12.69 44.58,12 44.92,11.66 44.92,9.6 41.83,6.51 37.72,6.51 37.03,5.83 37.03,4.12 P_2X4.P$2
N$31
  Top 0.432: R_3X1.1 71.32,86.75 71.32,83.67 72.69,82.3 72.69,81.61 71.67,80.58 64.47,80.58 63.09,81.95 P_3X1.P$2
N$32
  Top 0.432: C_COL3.1 24.35,23.66 24.35,36.69 29.83,42.18 30.18,42.18 32.23,44.23 IC_SUM_3_4.1 32.23,44.58 33.95,46.29 36.01,46.29 41.15,51.44 41.15,53.49 43.89,56.24 44.23,56.24 60.35,72.35 ATTENUATION2.3
N$34
  Top 0.432: R_3X2.1 70.98,59.66 61.38,59.66 58.98,57.26 58.98,55.21 59.66,54.52 61.72,54.52 63.09,55.89 P_3X2.P$2
N$35
  Top 0.432: C_COL3.2 26.4,23.32 26.4,4.8 24.35,2.74 JP10.1
N$36
  Bottom 0.432: R_3X3.1 70.29,33.6 69.61,33.6 68.24,32.23 67.89,32.23 67.21,32.92 64.12,32.92 63.09,31.89 63.09,30.18 P_3X3.P$2
N$37  (via drill 0.3)
  Top 0.432: 41.15,32.23 41.15,34.29 34.98,40.46 34.98,44.23 IC_SUM_3_4.2 | 41.15,32.23 41.15,28.8 39.09,26.75 39.09,8.23 46.29,1.03 63.09,1.03 64.81,2.74 64.81,3.09 65.49,3.77 P_3X4.P$3 | v53.15,31.55 64.12,31.55 65.49,30.18 P_3X3.P$3 | 50.06,32.92 45.61,32.92 44.92,32.23 41.15,32.23 | 50.06,32.92 v51.78,32.92 | 50.06,32.92 50.06,51.78 51.78,53.49 63.09,53.49 65.49,55.89 P_3X2.P$3
  Bottom 0.432: IC_SUM_3_4.2 34.98,44.58 34.98,45.26 34.63,45.61 34.63,45.95 33.6,46.98 30.52,46.98 29.49,45.95 29.15,46.29 R_COL3.2 | v51.78,32.92 v53.15,31.55 | P_3X1.P$3 65.49,81.95 65.49,78.87 63.09,76.47 63.09,75.78 62.75,75.44 62.75,74.07 63.09,73.72 63.09,73.38 63.78,72.69 63.78,60.01 65.84,57.95 65.84,56.24 P_3X2.P$3
N$38
  Top 0.432: R_3X4.1 70.98,12.69 70.98,11.32 65.15,5.49 64.47,5.49 63.09,4.12 P_3X4.P$2
N$39
  Bottom 0.432: R_4X1.1 96.36,86.07 95.67,86.07 94.3,84.7 93.95,84.7 93.61,85.04 90.18,85.04 89.15,84.01 89.15,82.3 P_4X1.P$2
N$40  (via drill 0.3)
  Top 0.432: v30.18,41.15 30.18,25.72 32.23,23.66 C_COL4.1 | v39.43,64.12 50.75,75.44 60.69,75.44 61.72,76.47 66.18,76.47 66.86,75.78 87.1,75.78 87.78,76.47 92.58,76.47 93.27,75.78 93.27,74.07 91.9,72.69 86.75,72.69 ATTENUATION3.3
  Bottom 0.432: 27.77,48.69 26.4,47.32 26.4,44.92 v30.18,41.15 | 27.77,48.69 28.12,49.03 33.26,49.03 34.63,50.41 34.63,51.78 IC_SUM_3_4.7 | v39.43,64.12 35.32,60.01 32.92,60.01 26.4,53.49 26.4,50.06 27.77,48.69
N$42
  Bottom 0.432: R_4X2.1 96.36,59.66 95.67,59.66 95.33,59.32 91.9,59.32 91.55,58.98 90.18,58.98 89.15,57.95 89.15,56.24 P_4X2.P$2
N$43
  Top 0.432: C_COL4.2 34.63,23.32 34.63,15.77 27.09,8.23 27.09,3.09 26.75,2.74 JP11.1
N$44
  Top 0.432: R_4X3.1 96.36,32.92 91.21,32.92 89.15,30.86 P_4X3.P$2
N$45  (via drill 0.3)
  Top 0.432: v96.36,75.78 96.36,69.61 90.18,63.44 90.18,59.66 91.55,58.29 91.55,56.24 P_4X2.P$3 91.9,55.89 94.64,53.15 96.36,53.15 98.07,51.44 98.07,45.26 97.73,44.92 v97.73,38.75 | R_COL4.2 43.2,45.95 58.29,61.04 79.9,61.04 90.87,72.01 92.24,72.01 93.95,73.72 93.95,79.9 91.9,81.95 P_4X1.P$3
  Bottom 0.432: P_4X4.P$3 91.9,4.12 91.9,7.89 90.18,9.6 90.18,27.09 91.9,28.8 91.9,30.52 P_4X3.P$3 91.9,30.86 91.9,32.92 v97.73,38.75 | IC_SUM_3_4.6 37.38,51.78 37.38,49.72 39.78,47.32 40.8,47.32 42.86,45.26 43.2,45.61 R_COL4.2 | v96.36,75.78 91.55,80.58 91.9,80.92 91.9,81.95 P_4X1.P$3
N$46
  Top 0.432: R_4X4.1 96.36,12.69 96.36,10.63 91.21,5.49 90.87,5.49 89.5,4.12 P_4X4.P$2
SIG_1  (via drill 0.3)
  Top 0.432: R_1X1.2 17.83,81.95 31.55,81.95 33.6,84.01 42.18,84.01 44.23,81.95 R_2X1.2 44.58,81.95 46.63,84.01 66.52,84.01 68.58,81.95 70.98,81.95 R_3X1.2 | 57.61,46.98 57.61,49.72 55.21,52.12 51.44,52.12 50.75,51.44 50.75,46.98 51.78,45.95 R_BUF_1.1 | 57.61,46.98 57.61,44.58 IC_SIG_1_2.1 | 88.81,64.12 80.92,56.24 70.64,56.24 66.86,52.46 66.86,50.41 63.44,46.98 57.61,46.98 | 88.81,64.12 94.64,69.95 94.64,78.52 96.36,80.24 96.36,81.27 R_4X1.2 | v86.41,66.18 88.47,64.12 88.81,64.12
  Bottom 0.432: v86.41,66.18 71.32,81.27 71.32,81.61 R_3X1.2
SIG_2  (via drill 0.3)
  Top 0.432: R_3X2.2 71.32,54.52 71.32,52.46 72.69,51.09 72.69,50.06 68.58,45.95 R_BUF_2.1 | v91.21,60.01 96.36,54.86 R_4X2.2
  Bottom 0.432: 47.32,57.95 47.32,62.06 42.86,66.52 30.18,66.52 18.52,54.86 17.83,54.86 R_1X2.2 | 47.32,57.95 44.23,54.86 R_2X2.2 | R_BUF_2.1 68.58,45.61 67.89,45.61 66.52,46.98 65.49,46.98 63.44,49.03 62.41,49.03 60.35,51.09 60.35,51.78 IC_SIG_1_2.7 60.35,52.12 60.35,52.46 59.66,52.46 54.18,57.95 47.32,57.95 | v91.21,60.01 90.87,59.66 76.81,59.66 72.01,54.86 71.32,54.86 R_3X2.2
SIG_3
  Top 0.432: 81.27,44.58 82.98,44.58 IC_SIG_3_4.1 | 81.27,44.58 80.24,45.61 R_BUF_3.1 | 77.84,37.03 81.27,40.46 81.27,44.58 | 77.84,37.03 70.64,29.83 70.64,28.8 R_3X3.2 | 77.84,37.03 86.75,28.12 96.36,28.12 R_4X3.2
  Bottom 0.432: 42.86,27.77 43.55,28.46 44.23,28.46 R_2X3.2 | 42.86,27.77 41.49,26.4 19.55,26.4 17.83,28.12 17.83,28.46 R_1X3.2 | 42.86,27.77 46.29,24.35 46.29,22.29 47.66,20.92 61.04,20.92 62.75,22.63 62.75,24.69 65.15,27.09 68.24,27.09 69.61,28.46 70.29,28.46 R_3X3.2
SIG_4
  Top 0.432: IC_SIG_3_4.7 85.72,51.78 86.75,51.78 91.21,47.32 94.98,47.32 96.36,45.95 R_BUF_4.1 96.7,45.61 96.7,34.98 98.07,33.6 98.07,19.2 96.7,17.83 R_4X4.2 96.36,17.83 71.32,17.83 R_3X4.2
  Bottom 0.432: R_1X4.2 17.83,17.83 18.52,17.83 18.86,18.17 19.89,18.17 20.57,17.49 44.23,17.49 R_2X4.2 44.58,17.49 45.26,17.49 46.63,16.12 68.58,16.12 70.29,17.83 70.98,17.83 R_3X4.2
SUM1  (via drill 0.3)
  Top 0.432: 6.17,27.09 6.17,33.95 8.57,36.35 8.57,49.38 7.2,50.75 R_COL1.2 7.2,51.09 9.6,53.49 10.97,53.49 12.34,54.86 12.34,55.21 13.03,55.89 P_1X2.P$3 13.03,56.24 13.03,63.78 15.43,66.18 15.43,76.12 13.37,78.18 13.37,81.95 P_1X1.P$3 | 6.17,27.09 6.17,14.4 13.03,7.54 13.03,4.12 P_1X4.P$3 | 6.17,27.09 v5.83,27.09
  Bottom 0.432: IC_SUM_1_2.2 12.69,44.58 12.69,45.61 7.2,51.09 R_COL1.2 | v5.83,27.09 12.69,27.09 13.37,27.77 13.37,29.83 P_1X3.P$3
V+  (via drill 0.3)
  Top 0.432: 76.47,23.32 79.9,23.32 C2.1 | 76.47,23.32 72.35,19.2 70.64,19.2 65.84,14.4 65.84,13.03 57.26,4.46 57.26,2.74 JP15.1 | v16.46,48.35 20.57,44.23 24.69,44.23 26.75,46.29 | 26.75,46.29 32.23,51.78 IC_SUM_3_4.8 | v61.38,45.95 66.18,45.95 67.89,44.23 73.04,44.23 | 73.04,44.23 78.18,49.38 80.58,49.38 82.98,51.78 IC_SIG_3_4.8 | v29.15,43.89 26.75,46.29 | v76.47,34.29 76.47,23.32 | v74.07,36.69 74.07,43.2 73.04,44.23
  Bottom 0.432: U$2.3 74.07,7.89 74.75,7.89 77.84,10.97 77.84,21.95 79.55,23.66 79.9,23.66 C2.1 | v16.46,48.35 11.32,48.35 9.94,49.72 9.94,51.78 IC_SUM_1_2.8 | 57.61,49.72 57.61,51.78 IC_SIG_1_2.8 | v61.38,45.95 57.61,49.72 | v29.15,43.89 31.2,41.83 44.23,41.83 50.75,48.35 56.24,48.35 57.61,49.72 | v74.07,36.69 v76.47,34.29

### Text on the board
tPlace: MATRIX 4x4 V0.2 / TOFSTOFF.COM
tValues: - | +